# EAGLE design ledflikerlessCct (EAGLE 6.3)
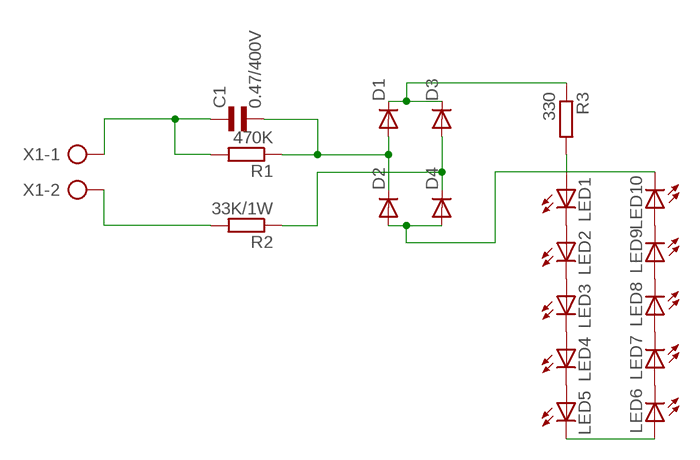
[diagram p0: schematic, sheet 1]

## Parts
C1  0.47/400V  EL-BI25-10AXIAL  [EU25-10]
D1  DIODE-D-5  [D-5]
D2  DIODE-D-5  [D-5]
D3  DIODE-D-5  [D-5]
D4  DIODE-D-5  [D-5]
LED1  LEDP-LCC-2-BACK  [P-LCC-2-TOPLED-RG]
LED2  LEDP-LCC-2-BACK  [P-LCC-2-TOPLED-RG]
LED3  LEDP-LCC-2-BACK  [P-LCC-2-TOPLED-RG]
LED4  LEDP-LCC-2-BACK  [P-LCC-2-TOPLED-RG]
LED5  LEDP-LCC-2-BACK  [P-LCC-2-TOPLED-RG]
LED6  LEDP-LCC-2-BACK  [P-LCC-2-TOPLED-RG]
LED7  LEDP-LCC-2-BACK  [P-LCC-2-TOPLED-RG]
LED8  LEDP-LCC-2-BACK  [P-LCC-2-TOPLED-RG]
LED9  LEDP-LCC-2-BACK  [P-LCC-2-TOPLED-RG]
LED10  LEDP-LCC-2-BACK  [P-LCC-2-TOPLED-RG]
R1  470K  R-EU_0207/10  [0207/10]
R2  33K/1W  R-EU_0411/15  [0411/15]
R3  330  R-EU_R1206  [R1206]
X1  AK300/2  [AK300/2]

## Nets
N$1: D1.C D3.C R3.1
N$2: C1.2 D1.A D2.C R1.1
N$3: D3.A D4.C R2.1
N$5: LED1.C LED2.A
N$6: C1.1 R1.2 X1.1
N$7: LED2.C LED3.A
N$8: R2.2 X1.2
N$9: LED1.A R3.2
N$10: D2.A D4.A LED10.C
N$11: LED3.C LED4.A
N$12: LED4.C LED5.A
N$13: LED6.C LED7.A
N$14: LED7.C LED8.A
N$15: LED8.C LED9.A
N$16: LED9.C LED10.A
N$17: LED5.C LED6.A

## Library data of the parts
C1 = rcl:EL-: BIPOLAR ELECTROLYTIC CAPACITOR
D1-D4 = diode:DIODE-: DIODE
LED1-LED10 = led:LED: LED OSRAM: - CHIPLED LG R971, LG N971, LY N971, LG Q971, LY Q971, LO R971, LY R971 LH N974, LH R974 LS Q976, LO Q976, LY Q976 LO Q996 - Hyper CHIPLED LW Q18S LB Q993, LB Q99A, LB R99A - SideLED LS A670, LO A670, LY A670, LG A670, LP A670 LB A673, LV A673, LT A673, LW A673 LH A674 LY A675 LS A676, LA A676, LO A676, LY A676, LW A676 LS A679, LY A679, LG A679 - Hyper Micro SIDELED® LS Y876, LA Y876, LO Y876, LY Y876 LT Y87S - SmartLED LW L88C, LW L88S LB L89C, LB L89S, LG L890 LS L89K, LO L89K, LY L89K LS L896, LA L896, LO L896, LY L896 - TOPLED LS T670, LO T670, LY T670, LG T670, LP T670 LSG T670, LSP T670, LSY T670, LOP T670, LYG T670 LG T671, LOG T671, LSG T671 LB T673, LV T673, LT T673, LW T673 LH T674 LS T676, LA T676, LO T676, LY T676, LB T676, LH T676, LSB T676, LW T676 LB T67C, LV T67C, LT T67C, LS T67K, LO T67K, LY T67K, LW E67C LS E67B, LA E67B, LO E67B, LY E67B, LB E67C, LV E67C, LT E67C LW T67C LS T679, LY T679, LG T679 LS T770, LO T770, LY T770, LG T770, LP T770 LB T773, LV T773, LT T773, LW T773 LH T774 LS E675, LA E675, LY E675, LS T675 LS T776, LA T776, LO T776, LY T776, LB T776 LHGB T686 LT T68C, LB T68C - Hyper Mini TOPLED® LB M676 - Mini TOPLED Santana® LG M470 LS M47K, LO M47K, LY M47K Source: http://www.osram.convergy.de LUXEON: - LUMILED® LXK2-PW12-R00, LXK2-PW12-S00, LXK2-PW14-U00, LXK2-PW14-V00 LXK2-PM12-R00, LXK2-PM12-S00, LXK2-PM14-U00 LXK2-PE12-Q00, LXK2-PE12-R00, LXK2-PE12-S00, LXK2-PE14-T00, LXK2-PE14-U00 LXK2-PB12-K00, LXK2-PB12-L00, LXK2-PB12-M00, LXK2-PB14-N00, LXK2-PB14-P00, LXK2-PB14-Q00 LXK2-PR12-L00, LXK2-PR12-M00, LXK2-PR14-Q00, LXK2-PR14-R00 LXK2-PD12-Q00, LXK2-PD12-R00, LXK2-PD12-S00 LXK2-PH12-R00, LXK2-PH12-S00 LXK2-PL12-P00, LXK2-PL12-Q00, LXK2-PL12-R00 Source: www.luxeon.com KINGBRIGHT: KA-3528ASYC Source: www.kingbright.com
R1-R3 = rcl:R-EU_: RESISTOR, European symbol
X1 = con-ptr500:AK300/2: CONNECTOR; OC_FARNELL: unknown; OC_NEWARK: unknown

## Board
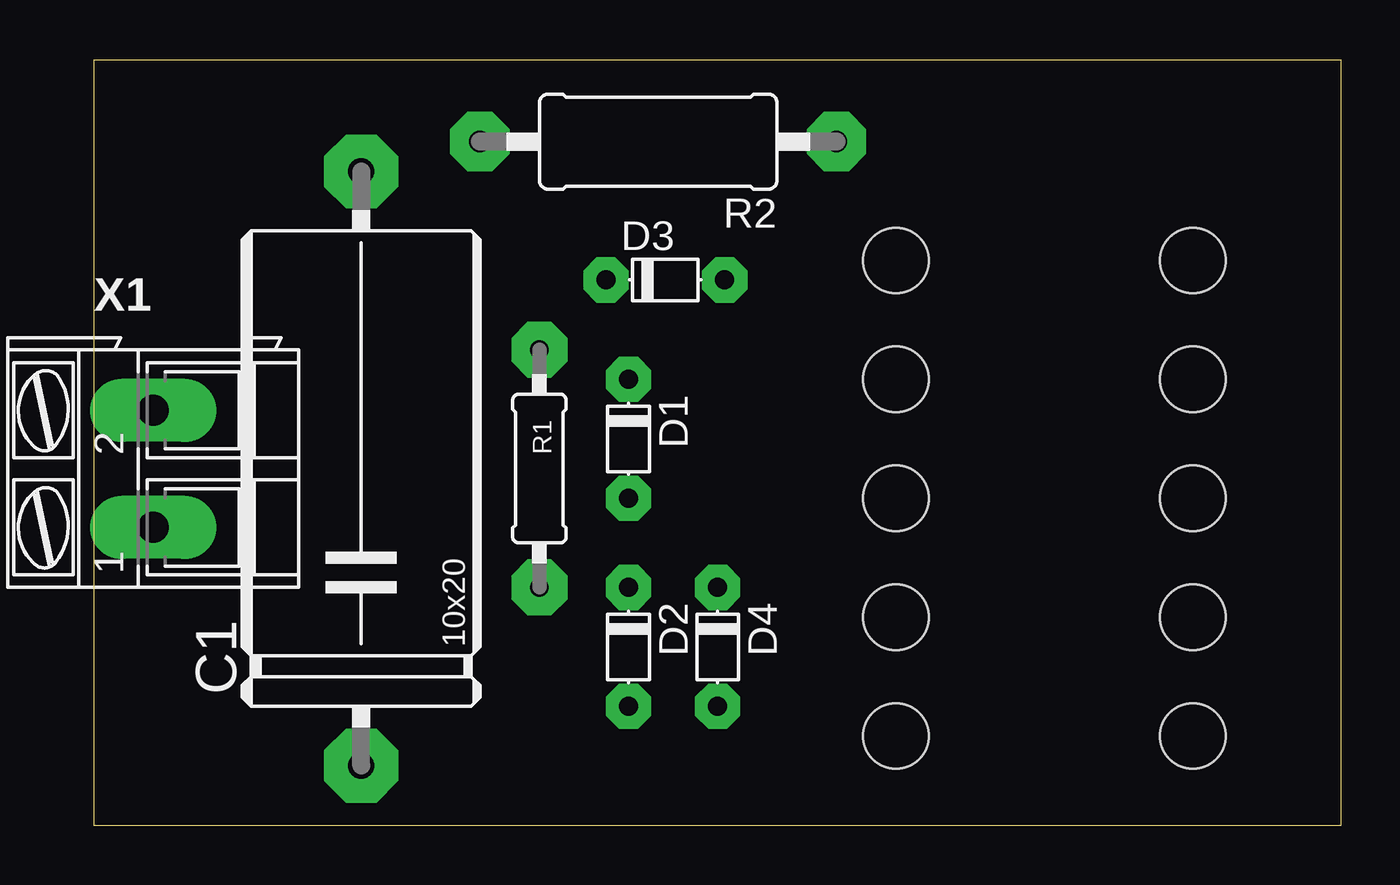
[diagram p1: board, top side]
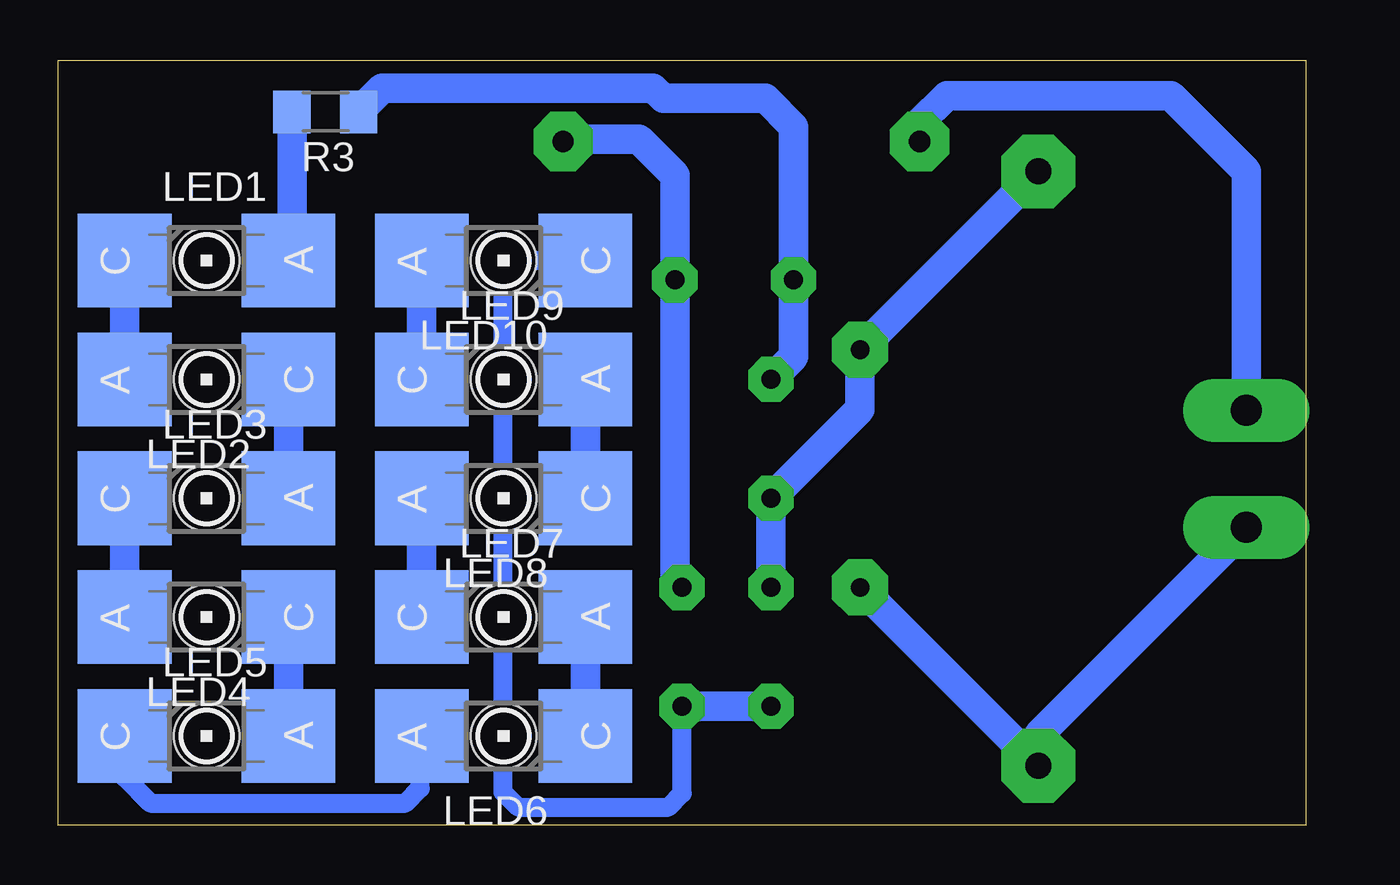
[diagram p2: board, bottom side, seen from below]

Size 53.32 x 32.69 mm. Coordinates in mm from the lower left corner, seen from the top.
Outline: 0,0 53.32,0 53.32,32.69 0,32.69 0,0
Copper layers (1*16): Top 0.035mm / dielectric 1.5mm / Bottom 0.035mm
Design rules "default": minimum track width 10mil, minimum drill 24mil, track to track 8mil, track to pad 8mil, pad to pad 8mil, via to via 8mil, smd to smd 8mil, copper to edge 40mil, drill to drill 8mil, minimum pad ring 10mil, minimum via ring 8mil, stop-mask expansion 4mil, vias tented up to drill 0mil, thermal gap 10mil

### Footprints (pad centres in the part's own frame; a part is rotated, then mirrored left to right if it is on the bottom)
EU25-10 = drill 1.118 pad 3.15 octagon: 1 -12.7,0; 2 12.7,0
D-5 = drill 0.813 pad 1.93 octagon: A 2.54,0; C -2.54,0
P-LCC-2-TOPLED-RG = smd 4 x 4: A 0,3.5; C 0,-3.5 | hole 2.8: 0,0
0207/10 = drill 0.8 pad 2.4 octagon: 1 -5.08,0; 2 5.08,0
0411/15 = drill 0.914 pad 2.54 octagon: 1 -7.62,0; 2 7.62,0
R1206 = smd 1.6 x 1.803: 1 -1.422,0; 2 1.422,0
AK300/2 = drill 1.321 pad 2.7 long: 1 -2.515,0; 2 2.489,0

### Placement (x,y rotation side)
C1  11.43,15.24 90 top
D1  22.86,16.51 270 top
D2  22.86,7.62 270 top
D3  24.43,23.3 0 top
D4  26.67,7.62 270 top
LED1  46.99,24.13 270 bottom
LED2  46.99,19.05 90 bottom
LED3  46.99,13.97 270 bottom
LED4  46.99,8.89 90 bottom
LED5  46.99,3.81 270 bottom
LED6  34.29,3.81 90 bottom
LED7  34.29,8.89 270 bottom
LED8  34.29,13.97 90 bottom
LED9  34.29,19.05 270 bottom
LED10  34.29,24.13 90 bottom
R1  19.05,15.24 270 top
R2  24.13,29.21 180 top
R3  41.91,30.48 180 bottom
X1  2.54,15.24 90 top

### Tracks (layer width: path | path; a pad name or v marks a point on that pad's centre or on a via)
N$1
  Bottom 1.27: D1.C 21.89,20.02 D3.C 21.89,29.85 23.09,31.06 27.46,31.06 27.9,31.49 39.47,31.49 R3.1
N$2
  Bottom 1.27: C1.2 R1.1 19.05,17.78 D1.A D2.C
N$3
  Bottom 1.27: R2.1 31.66,29.3 28.5,29.3 26.97,27.77 D3.A 26.97,10.46 D4.C
N$5
  Bottom 1.27: LED1.C LED2.A | LED2.A 50.49,18.59 50.41,18.51 50.41,18.97 LED2.A
N$6
  Bottom 1.27: X1.1 11.43,3.84 C1.1 R1.2
N$7
  Bottom 1.27: LED2.C LED3.A
N$8
  Bottom 1.27: X1.2 2.54,27.94 5.78,31.18 15.34,31.18 16.51,30.01 R2.2
N$9
  Bottom 1.27: R3.2 43.33,24.29 LED1.A
N$10
  Bottom 0.813: LED10.C 34.02,24.13 34.33,23.82 34.33,1.42 33.67,0.77 27.25,0.77 26.66,1.36 26.66,5.07 D4.A
  Bottom 1.27: D4.A D2.A
N$11
  Bottom 1.27: LED3.C LED4.A
N$12
  Bottom 1.27: LED4.C LED5.A
N$13
  Bottom 1.27: LED6.C LED7.A
N$14
  Bottom 1.27: LED7.C LED8.A
N$15
  Bottom 1.27: LED8.C LED9.A
N$16
  Bottom 1.27: LED9.C LED10.A
N$17
  Bottom 0.813: LED5.C 50.49,2.04 49.39,0.94 38.49,0.94 37.85,1.58 37.85,3.75
  Bottom 1.27: 37.85,3.75 LED6.A